# Altium schematic sheet CPUBoard_p2.SchDoc
size A4
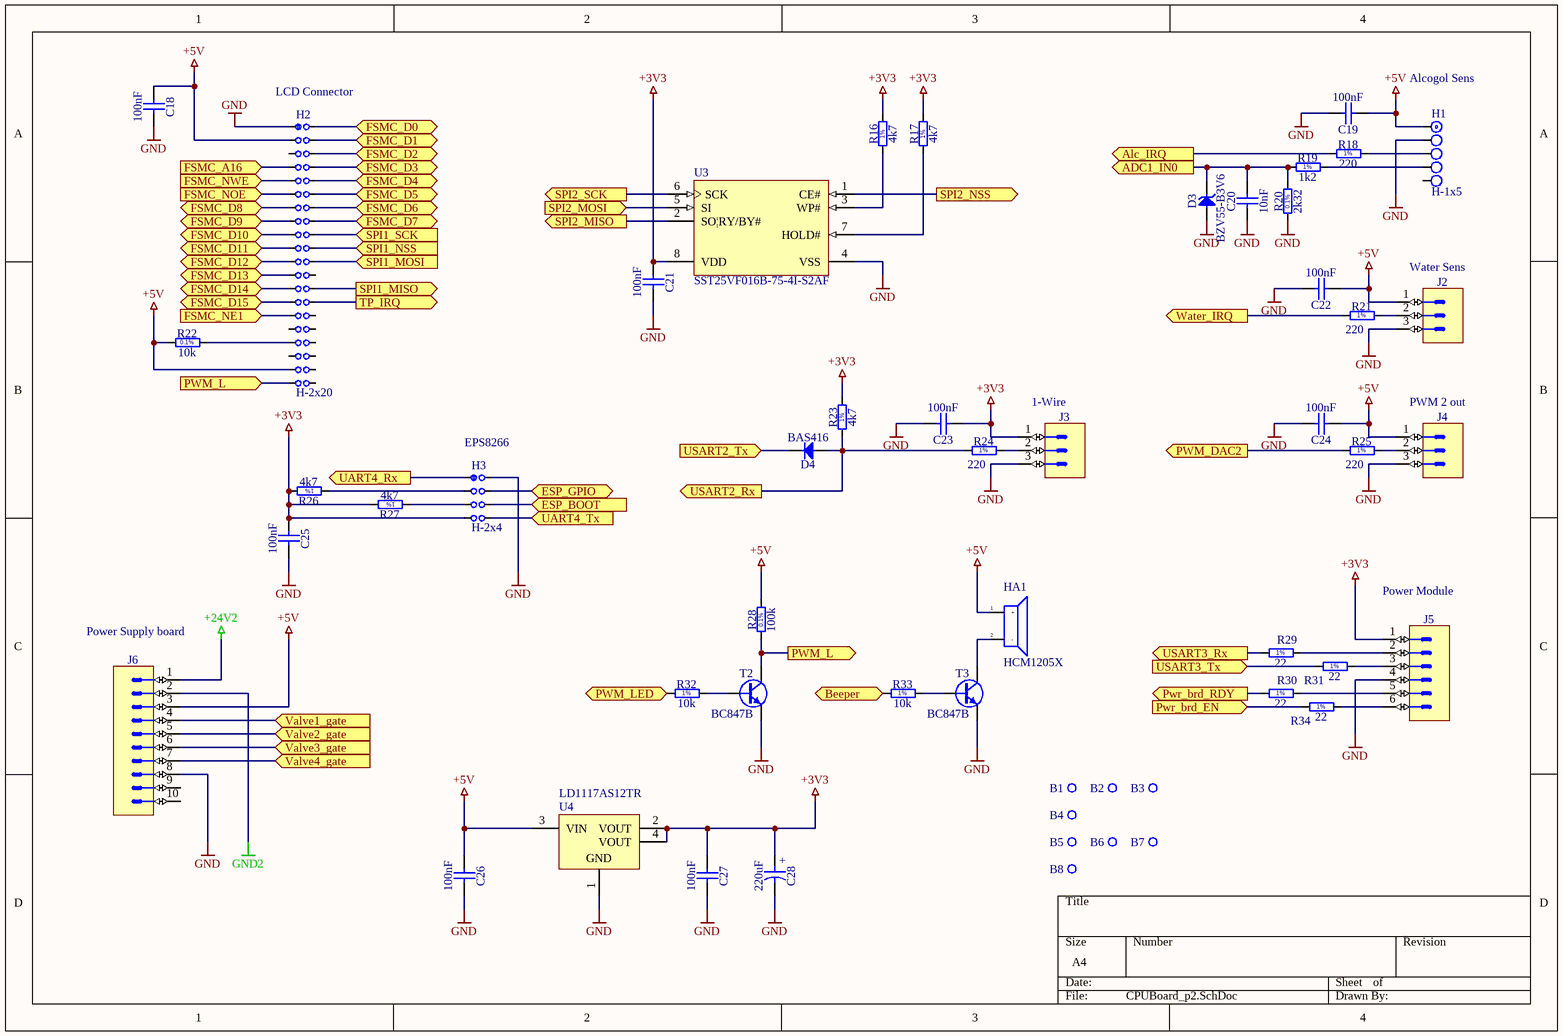
[diagram p0: CPUBoard_p2.SchDoc]

## Parts
B1  Plated Hole  [MTG350_650]  (value not drawn)
B2  Plated Hole  [MTG350_650]  (value not drawn)
B3  Plated Hole  [MTG350_650]  (value not drawn)
B4  Plated Hole  [MTG350_650]  (value not drawn)
B5  Plated Hole  [MTG350_650]  (value not drawn)
B6  Plated Hole  [MTG350_650]  (value not drawn)
B7  Plated Hole  [MTG350_650]  (value not drawn)
B8  Plated Hole  [MTG350_650]  (value not drawn)
C18  100nF  [CAPC2012X135N]
C19  100nF  [CAPC2012X135N]
C20  10nF  [CAPC2012X135N]
C21  100nF  [CAPC2012X135N]
C22  100nF  [CAPC2012X135N]
C23  100nF  [CAPC2012X135N]
C24  100nF  [CAPC2012X135N]
C25  100nF  [CAPC2012X135N]
C26  100nF  [CAPC2012X135N]
C27  100nF  [CAPC2012X135N]
C28  220uF  [CAPPR350-850X1300]
D3  BZV55-B3V6  [DIOMELF3515N]
D4  BAS416  [SOD2512X110N]
H1  H-1x5  [J1x5]
H2  H-2x20  [J2x20]
H3  H-2x4  [J2x4]
HA1  HCM1205X  [HCM1205X]
J2  KK®  [MOLEX_22-04-1031]  (value not drawn)
J3  KK®  [MOLEX_22-04-1031]  (value not drawn)
J4  KK®  [MOLEX_22-04-1031]  (value not drawn)
J5  KK®  [MOLEX_22-27-2061]  (value not drawn)
J6  C-Grid®  [MOLEX_70246-1004]  (value not drawn)
R16  4k7  [RESC2012X60N]
R17  4k7  [RESC2012X60N]
R18  220  [RESC2012X60N]
R19  1k2  [RESC2012X60N]
R20  2k32  [RESC2012X60N]
R21  220  [RESC2012X60N]
R22  10k  [RESC2012X60N]
R23  4k7  [RESC2012X60N]
R24  220  [RESC2012X60N]
R25  220  [RESC2012X60N]
R26  4k7  [RESC2012X60N]
R27  4k7  [RESC2012X60N]
R28  100k  [RESC2012X60N]
R29  22  [RESC2012X60N]
R30  22  [RESC2012X60N]
R31  22  [RESC2012X60N]
R32  10k  [RESC2012X60N]
R33  10k  [RESC2012X60N]
R34  22  [RESC2012X60N]
T2  BC847B  [SOT95P230X110-3N]
T3  BC847B  [SOT95P230X110-3N]
U3  SST25VF016B-75-4I-S2AF  [MCHP-SOIC-S2A8_N]
U4  LD1117AS12TR  [SOT-223_N]

## Ports
ADC1_IN0 (out), Alc_IRQ (out), Beeper (in), ESP_BOOT (in), ESP_GPIO (bidir), FSMC_A16 (in), FSMC_D0 (bidir), FSMC_D1 (bidir), FSMC_D2 (bidir), FSMC_D3 (bidir), FSMC_D4 (bidir), FSMC_D5 (bidir), FSMC_D6 (bidir), FSMC_D7 (bidir), FSMC_D8 (bidir), FSMC_D9 (bidir), FSMC_D10 (bidir), FSMC_D11 (bidir), FSMC_D12 (bidir), FSMC_D13 (bidir), FSMC_D14 (bidir), FSMC_D15 (bidir), FSMC_NE1 (in), FSMC_NOE (in), FSMC_NWE (in), PWM_DAC2 (out), PWM_L (in), PWM_L (out), PWM_LED (in), Pwr_brd_EN (in), Pwr_brd_RDY (out), SPI1_MISO (out), SPI1_MOSI (in), SPI1_NSS (in), SPI1_SCK (in), SPI2_MISO (out), SPI2_MOSI (in), SPI2_NSS (out), SPI2_SCK (out), TP_IRQ (out), UART4_Rx (out), UART4_Tx (in), USART2_Rx (out), USART2_Tx (in), USART3_Rx (out), USART3_Tx (in), Valve1_gate (in), Valve2_gate (in), Valve3_gate (in), Valve4_gate (in), Water_IRQ (out)

## Nets
+3V3: C21.1 C23.1 C25.1 C27.1 C28.1 H3.7 J3.1 J5.1 R16.2 R17.2 R23.2 R26.2 R27.2 U3.8(VDD) U4.2(VOUT) U4.4(VOUT)
+5V: C18.1 C19.1 C22.1 C24.1 C26.1 H1.1 H2.3 H2.37 HA1.1(+) J2.1 J4.1 J6.3 R22.1 R28.2 U4.3(VIN)
+24V2: J6.1
GND: C18.2 C19.2 C20.1 C21.2 C22.2 C23.2 C24.2 C25.2 C26.2 C27.2 C28.2 D3.2(A) H1.2 H2.1 H3.2 J2.3 J3.3 J4.3 J5.4 J6.8 R20.1 T2.2(E) T3.2(E) U3.4(VSS) U4.1(GND)
GND2: J6.2
ADC1_IN0: C20.2 D3.1(C) R19.1 R20.2 ; port ADC1_IN0
Alc_IRQ: R18.1 ; port Alc_IRQ
Beeper: R33.1 ; port Beeper
ESP_BOOT: H3.6 ; port ESP_BOOT
ESP_GPIO: H3.4 ; port ESP_GPIO
FSMC_A16: H2.7 ; port FSMC_A16
FSMC_D0: H2.2 ; port FSMC_D0
FSMC_D1: H2.4 ; port FSMC_D1
FSMC_D2: H2.6 ; port FSMC_D2
FSMC_D3: H2.8 ; port FSMC_D3
FSMC_D4: H2.10 ; port FSMC_D4
FSMC_D5: H2.12 ; port FSMC_D5
FSMC_D6: H2.14 ; port FSMC_D6
FSMC_D7: H2.16 ; port FSMC_D7
FSMC_D8: H2.13 ; port FSMC_D8
FSMC_D9: H2.15 ; port FSMC_D9
FSMC_D10: H2.17 ; port FSMC_D10
FSMC_D11: H2.19 ; port FSMC_D11
FSMC_D12: H2.21 ; port FSMC_D12
FSMC_D13: H2.23 ; port FSMC_D13
FSMC_D14: H2.25 ; port FSMC_D14
FSMC_D15: H2.27 ; port FSMC_D15
FSMC_NE1: H2.29 ; port FSMC_NE1
FSMC_NOE: H2.11 ; port FSMC_NOE
FSMC_NWE: H2.9 ; port FSMC_NWE
PWM_DAC2: R25.1 ; port PWM_DAC2
PWM_L: H2.39 R28.1 T2.3(C) ; port PWM_L
PWM_LED: R32.1 ; port PWM_LED
Pwr_brd_EN: R34.1 ; port Pwr_brd_EN
Pwr_brd_RDY: R30.1 ; port Pwr_brd_RDY
SPI1_MISO: H2.26 ; port SPI1_MISO
SPI1_MOSI: H2.22 ; port SPI1_MOSI
SPI1_NSS: H2.20 ; port SPI1_NSS
SPI1_SCK: H2.18 ; port SPI1_SCK
SPI2_MISO: U3.2(SO|RY/BY#) ; port SPI2_MISO
SPI2_MOSI: U3.5(SI) ; port SPI2_MOSI
SPI2_NSS: U3.1(CE#) ; port SPI2_NSS
SPI2_SCK: U3.6(SCK) ; port SPI2_SCK
TP_IRQ: H2.28 ; port TP_IRQ
UART4_Rx: H3.1 ; port UART4_Rx
UART4_Tx: H3.8 ; port UART4_Tx
USART2_Rx: D4.2(A) R23.1 R24.1 ; port USART2_Rx
USART2_Tx: D4.1(C) ; port USART2_Tx
USART3_Rx: R29.1 ; port USART3_Rx
USART3_Tx: R31.1 ; port USART3_Tx
Valve1_gate: J6.4 ; port Valve1_gate
Valve2_gate: J6.5 ; port Valve2_gate
Valve3_gate: J6.6 ; port Valve3_gate
Valve4_gate: J6.7 ; port Valve4_gate
Water_IRQ: R21.1 ; port Water_IRQ
NetH1_3: H1.3 R18.2
NetH1_4: H1.4 R19.2
NetH2_33: H2.33 R22.2
NetH3_3: H3.3 R26.1
NetH3_5: H3.5 R27.1
NetHA1_2: HA1.2(-) T3.3(C)
NetJ2_2: J2.2 R21.2
NetJ3_2: J3.2 R24.2
NetJ4_2: J4.2 R25.2
NetJ5_2: J5.2 R29.2
NetJ5_3: J5.3 R31.2
NetJ5_5: J5.5 R30.2
NetJ5_6: J5.6 R34.2
NetR16_1: R16.1 U3.3(WP#)
NetR17_1: R17.1 U3.7(HOLD#)
NetR32_2: R32.2 T2.1(B)
NetR33_2: R33.2 T3.1(B)

Not connected (* = marked no-connect by the designer): B1 1; B2 1; B3 1; B4 1; B5 1; B6 1; B7 1; B8 1; H1 5; H2 5 24 30 31 32 34 35 36 38 40; J6 9 10

## Notes on the sheet
- (near H2) LCD Connector
- Alcogol Sens
- (near J2) Water Sens
- (near H3) EPS8266
- (near J3) 1-Wire
- (near J4) PWM 2 out
- (near J6) Power Supply board
- (near J5) Power Module
- (in symbol CAER_220UF_25V_20%_RUBYCON_25YXF220M8X11.5) +
- (in symbol R0805_1K2_1%_0.125W_100PPM) 1%
- (in symbol R0805_2K32_0.1%_0.1W_10PPM) 0.1%
- (in symbol R0805_4K7_1%_0.125W_100PPM) 1%
- (in symbol R0805_10K_0.1%_0.1W_10PPM) 0.1%
- (in symbol R0805_10K_1%_0.125W_100PPM) 1%
- (in symbol R0805_22R_1%_0.125W_100PPM) 1%
- (in symbol R0805_100K_0.1%_0.1W_10PPM) 0.1%
- (in symbol R0805_220R_1%_0.125W_100PPM) 1%

## Library data of the parts
B1-B8 = PLATED_HOLE3.5_PAD6.5: Single Terminal Socket; Part Description: Plated Through Hole: Hole Dia.=3.5mm Pad Dia.=6.5mm; Mounted: No; Table: Pads; Part Number: PLATED_HOLE3.5_PAD6.5; Component Kind: Standard (No BOM); Component Type: Standard (No BOM); Pin Count: 1; Family: Plated Hole; Socket: No; SMD: No; Status: None; ComponentHeight: 0mm; Author: CERN DEM JLC; CreateDate: 20.11.2008; LatestRevisionDate: 23.11.2011; PackageDescription: Plated Through Hole: Hole Dia.=3.5mm Pad Dia.=6.5mm
C18 C19 C21-C27 = CC0805_100NF_50V_10%_X7R: Non-polarised capacitor; Part Description: SMD Multilayer Chip Ceramic Capacitor; Manufacturer: GENERIC; Manufacturer1 Part Number: B37941K5104K62; Voltage: 50V; TC: X7R; Tolerance: ±10%; Table: Capacitors SMD; Part Number: CC0805_100NF_50V_10%_X7R; Component Kind: Standard; Component Type: Standard; Pin Count: 2; Value: 100nF; Status: Preferred; Manufacturer Part Number: CC0805_100NF_50V_10%_X7R; Case: 0805; Mounted: Yes; Socket: No; SMD: Yes; Manufacturer1 Example: EPCOS; Manufacturer1 ComponentHeight: 1.35mm; HelpURL: \\cern.ch\dfs\Applications\Altium\Datasheets\CC0805_X7R_EPCOS.pdf; Author: CERN DEM JLC; CreateDate: 03.12.2007; LatestRevisionDate: 03.12.2007
C20 = CC0805_10NF_50V_5%_X7R: Non-polarised capacitor; Part Description: SMD Multilayer Chip Ceramic Capacitor; Manufacturer: GENERIC; Manufacturer1 Part Number: 08055C103JAT2A; Voltage: 50V; TC: X7R; Tolerance: ±5%; Table: Capacitors SMD; Part Number: CC0805_10NF_50V_5%_X7R; Component Kind: Standard; Component Type: Standard; Pin Count: 2; Value: 10nF; Status: None; Manufacturer Part Number: CC0805_10NF_50V_5%_X7R; Case: 0805; Mounted: Yes; Socket: No; SMD: Yes; Manufacturer1 Example: AVX; Manufacturer1 ComponentHeight: 0.94mm; HelpURL: \\cern.ch\dfs\Applications\Altium\Datasheets\CC0805_X7R_AVX.pdf; Author: CERN DEM JLC; CreateDate: 18.01.2011; LatestRevisionDate: 18.01.2011
C28 = CAER_220UF_25V_20%_RUBYCON_25YXF220M8X11.5: Polarised capacitor; Part Description: Radial Miniature, Aluminum Electrolytic Capacitor, (YXF Series); Voltage: 25V; Tolerance: ±20%; Table: Capacitors THD; Part Number: CAER_220UF_25V_20%_RUBYCON_25YXF220M8X11.5; Component Kind: Standard; Component Type: Standard; Pin Count: 2; Value: 220uF; Status: None; Manufacturer: RUBYCON; Manufacturer Part Number: 25YXF220M8X11.5; Case: LS3.5 D8.5 x H13; Mounted: Yes; Socket: No; SMD: No; ComponentHeight: 13mm; HelpURL: \\cern.ch\dfs\Applications\Altium\Datasheets\CAER_RUBYCON_YXF.pdf; Author: CERN DEM JLC; CreateDate: 20.08.2009; LatestRevisionDate: 17.09.2009
D3 = BZV55-B3V6: Zener Diode; Part Description: Voltage Regulator Diode; Manufacturer: NXP SEMICONDUCTORS; Voltage: 3V6; Power: 500mW; Table: Diodes; Part Number: BZV55-B3V6; Component Kind: Standard; Component Type: Standard; Device: BZV55-B3V6; PackageDescription: SOD80C, MELF Diode, 2-Leads, Body 3.5x1.5mm, IPC Medium Density; Manufacturer Part Number: BZV55-B3V6; Pin Count: 2; Case: SOD-80C; Mounted: Yes; Socket: No; SMD: Yes; ComponentHeight: 1.6mm; HelpURL: \\cern.ch\dfs\Applications\Altium\Datasheets\BZV55.pdf; Author: CERN DEM JLC; CreateDate: 06.05.2008; LatestRevisionDate: 06.05.2008
D4 = BAS416: Diode; Part Description: Low-Leakage Diode; Manufacturer: NXP SEMICONDUCTORS; Voltage: 75V; Power: 200mA; Table: Diodes; Part Number: BAS416; Component Kind: Standard; Component Type: Standard; Device: BAS416; PackageDescription: Small Outline Diode Flat Lead (SOD-323), 1.70mm W X 1.25mm L X 1.10mm H body,  IPC Medium Density; Manufacturer Part Number: BAS416; Pin Count: 2; Case: SOD323; Mounted: Yes; Socket: No; SMD: Yes; ComponentHeight: 1.1mm; HelpURL: \\cern.ch\dfs\Applications\Altium\Datasheets\BAS416.pdf; Author: CERN DEM JLC; CreateDate: 01.10.2013; LatestRevisionDate: 01.10.2013
J2-J4 = MOLEX_22-04-1031: Connector 3 Male; Part Description: 2.5mm (.100") Pitch KK® Wire-to-Board Header, Vertical, with Friction Lock, 3 Circuits, Tin (Sn) Plating; Manufacturer: MOLEX; Part Number: MOLEX_22-04-1031; Component Kind: Standard; Component Type: Standard; Pin Count: 3; Family: KK®; Mounted: Yes; Socket: No; SMD: No; Status: None; Manufacturer Part Number: 22-04-1031; ComponentHeight: 11.7mm; HelpURL: \\cern.ch\dfs\Applications\Altium\Datasheets\MOLEX_22-04-1031.pdf; Author: CERN DEM JLC; CreateDate: 09.02.2012; LatestRevisionDate: 09.02.2012; Table: MOLEX
J5 = MOLEX_22-27-2061: Connector 6 Male; Part Description: 2.54mm (.100") Pitch KK® Wire-to-Board Header, Vertical, with Friction Lock, 6 Circuits, Tin (Sn) Plating; Manufacturer: MOLEX; Part Number: MOLEX_22-27-2061; Component Kind: Standard; Component Type: Standard; Pin Count: 6; Family: KK®; Mounted: Yes; Socket: No; SMD: No; Status: None; Manufacturer Part Number: 22-27-2061; ComponentHeight: 11.7mm; HelpURL: \\cern.ch\dfs\Applications\Altium\Datasheets\MOLEX_22-27-2061.pdf; Author: CERN DEM JMW; CreateDate: 30.11.2011; LatestRevisionDate: 30.11.2011; Table: MOLEX
J6 = MOLEX_70246-1004: Connector 10 Male; Part Description: 2.54mm Pitch C-Grid® Header, Low Profile, Dual Row, Vertical, Shrouded Header; Manufacturer: MOLEX; Part Number: MOLEX_70246-1004; Component Kind: Standard; Component Type: Standard; Pin Count: 10; Family: C-Grid®; Mounted: Yes; Socket: No; SMD: No; Status: None; Manufacturer Part Number: 70246-1004; ComponentHeight: 9.27mm; HelpURL: \\cern.ch\dfs\Applications\Altium\Datasheets\MOLEX_70246-1004.pdf; Author: CERN DEM JLC; CreateDate: 14.08.2013; LatestRevisionDate: 14.08.2013; Table: MOLEX
R16 R17 R23 R26 R27 = R0805_4K7_1%_0.125W_100PPM: Resistor - 1%; Part Description: General Purpose Thick Film Chip Resistor; Manufacturer: GENERIC; Manufacturer1 Part Number: NRC10F4701TRF; Power: 0.125W; TC: ±100ppm/°C; Table: Resistors SMD; Part Number: R0805_4K7_1%_0.125W_100PPM; Component Kind: Standard; Component Type: Standard; Pin Count: 2; Value: 4k7; Status: Preferred; Tolerance: ±1%; Manufacturer Part Number: R0805_4K7_1%_0.125W_100PPM; Case: 0805; Mounted: Yes; Socket: No; SMD: Yes; Manufacturer1 Example: NIC COMPONENT; Manufacturer1 ComponentHeight: 0.6mm; HelpURL: \\cern.ch\dfs\Applications\Altium\Datasheets\R0805_NIC_NRC.pdf; Author: CERN DEM JLC; CreateDate: 03.12.2007; LatestRevisionDate: 13.03.2008
R18 R21 R24 R25 = R0805_220R_1%_0.125W_100PPM: Resistor - 1%; Part Description: General Purpose Thick Film Chip Resistor; Manufacturer: GENERIC; Manufacturer1 Part Number: NRC10F2200TRF; Power: 0.125W; TC: ±100ppm/°C; Table: Resistors SMD; Part Number: R0805_220R_1%_0.125W_100PPM; Component Kind: Standard; Component Type: Standard; Pin Count: 2; Value: 220; Status: Preferred; Tolerance: ±1%; Manufacturer Part Number: R0805_220R_1%_0.125W_100PPM; Case: 0805; Mounted: Yes; Socket: No; SMD: Yes; Manufacturer1 Example: NIC COMPONENT; Manufacturer1 ComponentHeight: 0.6mm; HelpURL: \\cern.ch\dfs\Applications\Altium\Datasheets\R0805_NIC_NRC.pdf; Author: CERN DEM JLC; CreateDate: 03.12.2007; LatestRevisionDate: 13.03.2008
R19 = R0805_1K2_1%_0.125W_100PPM: Resistor - 1%; Part Description: General Purpose Thick Film Chip Resistor; Manufacturer: GENERIC; Manufacturer1 Part Number: NRC10F1201TRF; Power: 0.125W; TC: ±100ppm/°C; Table: Resistors SMD; Part Number: R0805_1K2_1%_0.125W_100PPM; Component Kind: Standard; Component Type: Standard; Pin Count: 2; Value: 1k2; Status: Preferred; Tolerance: ±1%; Manufacturer Part Number: R0805_1K2_1%_0.125W_100PPM; Case: 0805; Mounted: Yes; Socket: No; SMD: Yes; Manufacturer1 Example: NIC COMPONENT; Manufacturer1 ComponentHeight: 0.6mm; HelpURL: \\cern.ch\dfs\Applications\Altium\Datasheets\R0805_NIC_NRC.pdf; Author: CERN DEM JLC; CreateDate: 03.12.2007; LatestRevisionDate: 13.03.2008
R20 = R0805_2K32_0.1%_0.1W_10PPM: Resistor - 0.1%; Part Description: Thin Film Chip Resistor; Manufacturer: GENERIC; Manufacturer1 Part Number: RN73C2A2K32BTG; Power: 0.1W; TC: ±10ppm; Table: Resistors SMD; Part Number: R0805_2K32_0.1%_0.1W_10PPM; Component Kind: Standard; Component Type: Standard; Pin Count: 2; Value: 2k32; Status: Not recommended; Tolerance: ±0.1%; Manufacturer Part Number: R0805_2K32_0.1%_0.1W_10PPM; Case: 0805; Mounted: Yes; Socket: No; SMD: Yes; Manufacturer1 Example: TYCO HOLSWORTHY; Manufacturer1 ComponentHeight: 0.6mm; HelpURL: \\cern.ch\dfs\Applications\Altium\Datasheets\R0805_Tyco_RN73.pdf; Author: CERN DEM JLC; CreateDate: 03.12.2007; LatestRevisionDate: 13.03.2008
R22 = R0805_10K_0.1%_0.1W_10PPM: Resistor - 0.1%; Part Description: Thin Film Chip Resistor; Manufacturer: GENERIC; Manufacturer1 Part Number: RN73C2A10KBTG; Power: 0.1W; TC: ±10ppm; Table: Resistors SMD; Part Number: R0805_10K_0.1%_0.1W_10PPM; Component Kind: Standard; Component Type: Standard; Pin Count: 2; Value: 10k; Status: Not recommended; Tolerance: ±0.1%; Manufacturer Part Number: R0805_10K_0.1%_0.1W_10PPM; Case: 0805; Mounted: Yes; Socket: No; SMD: Yes; Manufacturer1 Example: TYCO HOLSWORTHY; Manufacturer1 ComponentHeight: 0.6mm; HelpURL: \\cern.ch\dfs\Applications\Altium\Datasheets\R0805_Tyco_RN73.pdf; Author: CERN DEM JLC; CreateDate: 03.12.2007; LatestRevisionDate: 13.03.2008
R28 = R0805_100K_0.1%_0.1W_10PPM: Resistor - 0.1%; Part Description: Thin Film Chip Resistor; Manufacturer: GENERIC; Manufacturer1 Part Number: RN73C2A100KBTG; Power: 0.1W; TC: ±10ppm; Table: Resistors SMD; Part Number: R0805_100K_0.1%_0.1W_10PPM; Component Kind: Standard; Component Type: Standard; Pin Count: 2; Value: 100k; Status: Not recommended; Tolerance: ±0.1%; Manufacturer Part Number: R0805_100K_0.1%_0.1W_10PPM; Case: 0805; Mounted: Yes; Socket: No; SMD: Yes; Manufacturer1 Example: TYCO HOLSWORTHY; Manufacturer1 ComponentHeight: 0.6mm; HelpURL: \\cern.ch\dfs\Applications\Altium\Datasheets\R0805_Tyco_RN73.pdf; Author: CERN DEM JLC; CreateDate: 03.12.2007; LatestRevisionDate: 13.03.2008
R29-R31 R34 = R0805_22R_1%_0.125W_100PPM: Resistor - 1%; Part Description: General Purpose Thick Film Chip Resistor; Manufacturer: GENERIC; Manufacturer1 Part Number: NRC10F22R0TRF; Power: 0.125W; TC: ±100ppm/°C; Table: Resistors SMD; Part Number: R0805_22R_1%_0.125W_100PPM; Component Kind: Standard; Component Type: Standard; Pin Count: 2; Value: 22; Status: Preferred; Tolerance: ±1%; Manufacturer Part Number: R0805_22R_1%_0.125W_100PPM; Case: 0805; Mounted: Yes; Socket: No; SMD: Yes; Manufacturer1 Example: NIC COMPONENT; Manufacturer1 ComponentHeight: 0.6mm; HelpURL: \\cern.ch\dfs\Applications\Altium\Datasheets\R0805_NIC_NRC.pdf; Author: CERN DEM JLC; CreateDate: 03.12.2007; LatestRevisionDate: 13.03.2008
R32 R33 = R0805_10K_1%_0.125W_100PPM: Resistor - 1%; Part Description: General Purpose Thick Film Chip Resistor; Manufacturer: GENERIC; Manufacturer1 Part Number: NRC10F1002TRF; Power: 0.125W; TC: ±100ppm/°C; Table: Resistors SMD; Part Number: R0805_10K_1%_0.125W_100PPM; Component Kind: Standard; Component Type: Standard; Pin Count: 2; Value: 10k; Status: Preferred; Tolerance: ±1%; Manufacturer Part Number: R0805_10K_1%_0.125W_100PPM; Case: 0805; Mounted: Yes; Socket: No; SMD: Yes; Manufacturer1 Example: NIC COMPONENT; Manufacturer1 ComponentHeight: 0.6mm; HelpURL: \\cern.ch\dfs\Applications\Altium\Datasheets\R0805_NIC_NRC.pdf; Author: CERN DEM JLC; CreateDate: 03.12.2007; LatestRevisionDate: 13.03.2008
T2 T3 = BC847B: NPN Transistor; Part Description: 45V 100mA NPN general-purpose transistors; Manufacturer: NXP SEMICONDUCTORS; Table: Transistors; Part Number: BC847B; Component Kind: Standard; Component Type: Standard; Device: BC847B; PackageDescription: SOT23, 3 pin, Pitch 0.95mm - 1.3mm W X 2.9mm L X 1.1mm H, IPC Medium Density; Manufacturer Part Number: BC847B; Pin Count: 3; Case: SOT23-3; Mounted: Yes; Socket: No; SMD: Yes; ComponentHeight: 1.1mm; HelpURL: \\cern.ch\dfs\Applications\Altium\Datasheets\BC847B.pdf; Author: CERN DEM JLC; CreateDate: 14.06.2011; LatestRevisionDate: 14.06.2011
U3 = SST25VF016B-75-4I-S2AF: 16 Mbit SPI Serial Flash, 2.7 to 3.6 V, 80 MHz, -40 to 85 degC, 8-pin SOIC (S2A8), Tube; Manufacturer: Microchip; DatasheetVersion: Rev. A; PackageVersion: Rev. A; PackageReference: SOIC-S2A8; PackageDescription: 8-Lead Plastic Small Outline Intergrated Circuit, 5.275 x 5.275 mm Body, 1.27 mm Pitch; Supplier 1: Digi-Key; Supplier Part Number 1: SST25VF016B-75-4I-S2AF-ND; Supplier 2: Farnell; Supplier Part Number 2: 1829951; Supplier 3: Newark; Supplier Part Number 3: 82R4475; Supplier 4: Mouser; Supplier Part Number 4: 579-25VF016B7IS2AF; Mounting Technology: Surface Mount; PartNumber: SST25VF016B-75-4I-S2AF; ComponentLink1Description: Manufacturer URL; ComponentLink1URL: http://www.microchip.com; ComponentLink2Description: Datasheet; ComponentLink2URL: http://ww1.microchip.com/downloads/en/DeviceDoc/25044A.pdf; ComponentLink3Description: Package Specification; ComponentLink3URL: http://ww1.microchip.com/downloads/en/DeviceDoc/25051A.pdf; ComponentLink4Description: Product URL; ComponentLink4URL: http://www.microchip.com/SST25VF016B
U4 = LD1117AS12TR: 1A, Low Drop Positive Voltage Regulator, 1.2V, 4-Pin SOT-223, Tape and Reel; DatasheetVersion: Dec-2011; PackageVersion: 2010; PackageReference: SOT-223; PackageDescription: 4-Pin SOT-223 Package, 6.5 x 3.5 mm Body, 2.3 mm Pitch, 7 mm Lead Span; PartNumber: LD1117AS12TR; ComponentLink1Description: Manufacturer URL; ComponentLink1URL: http://www.st.com; ComponentLink2Description: Datasheet; ComponentLink2URL: http://www.st.com/internet/com/TECHNICAL_RESOURCES/TECHNICAL_LITERATURE/DATASHEET/CD00002116.pdf
H1 = H-1x5: Price: 0.05
H2 = H-2x20: Price: 0.40
H3 = H-2x4: Price: 0.08